# Altium schematic sheet ELOAD.SchDoc: =DocumentName
size 420 x 297 mm; CompanyName: "AS Manufacturing" LLC; Organization: "AS Manufacturing" LLC; Address1: 5 Sklyarenka St.; Address2: Kyiv 04073; Address3: Ukraine; Address4: https://ajax.systems/en/; DocumentNumber: 1; SheetNumber: 1; SheetTotal: 7; Template_version: 1.0.1
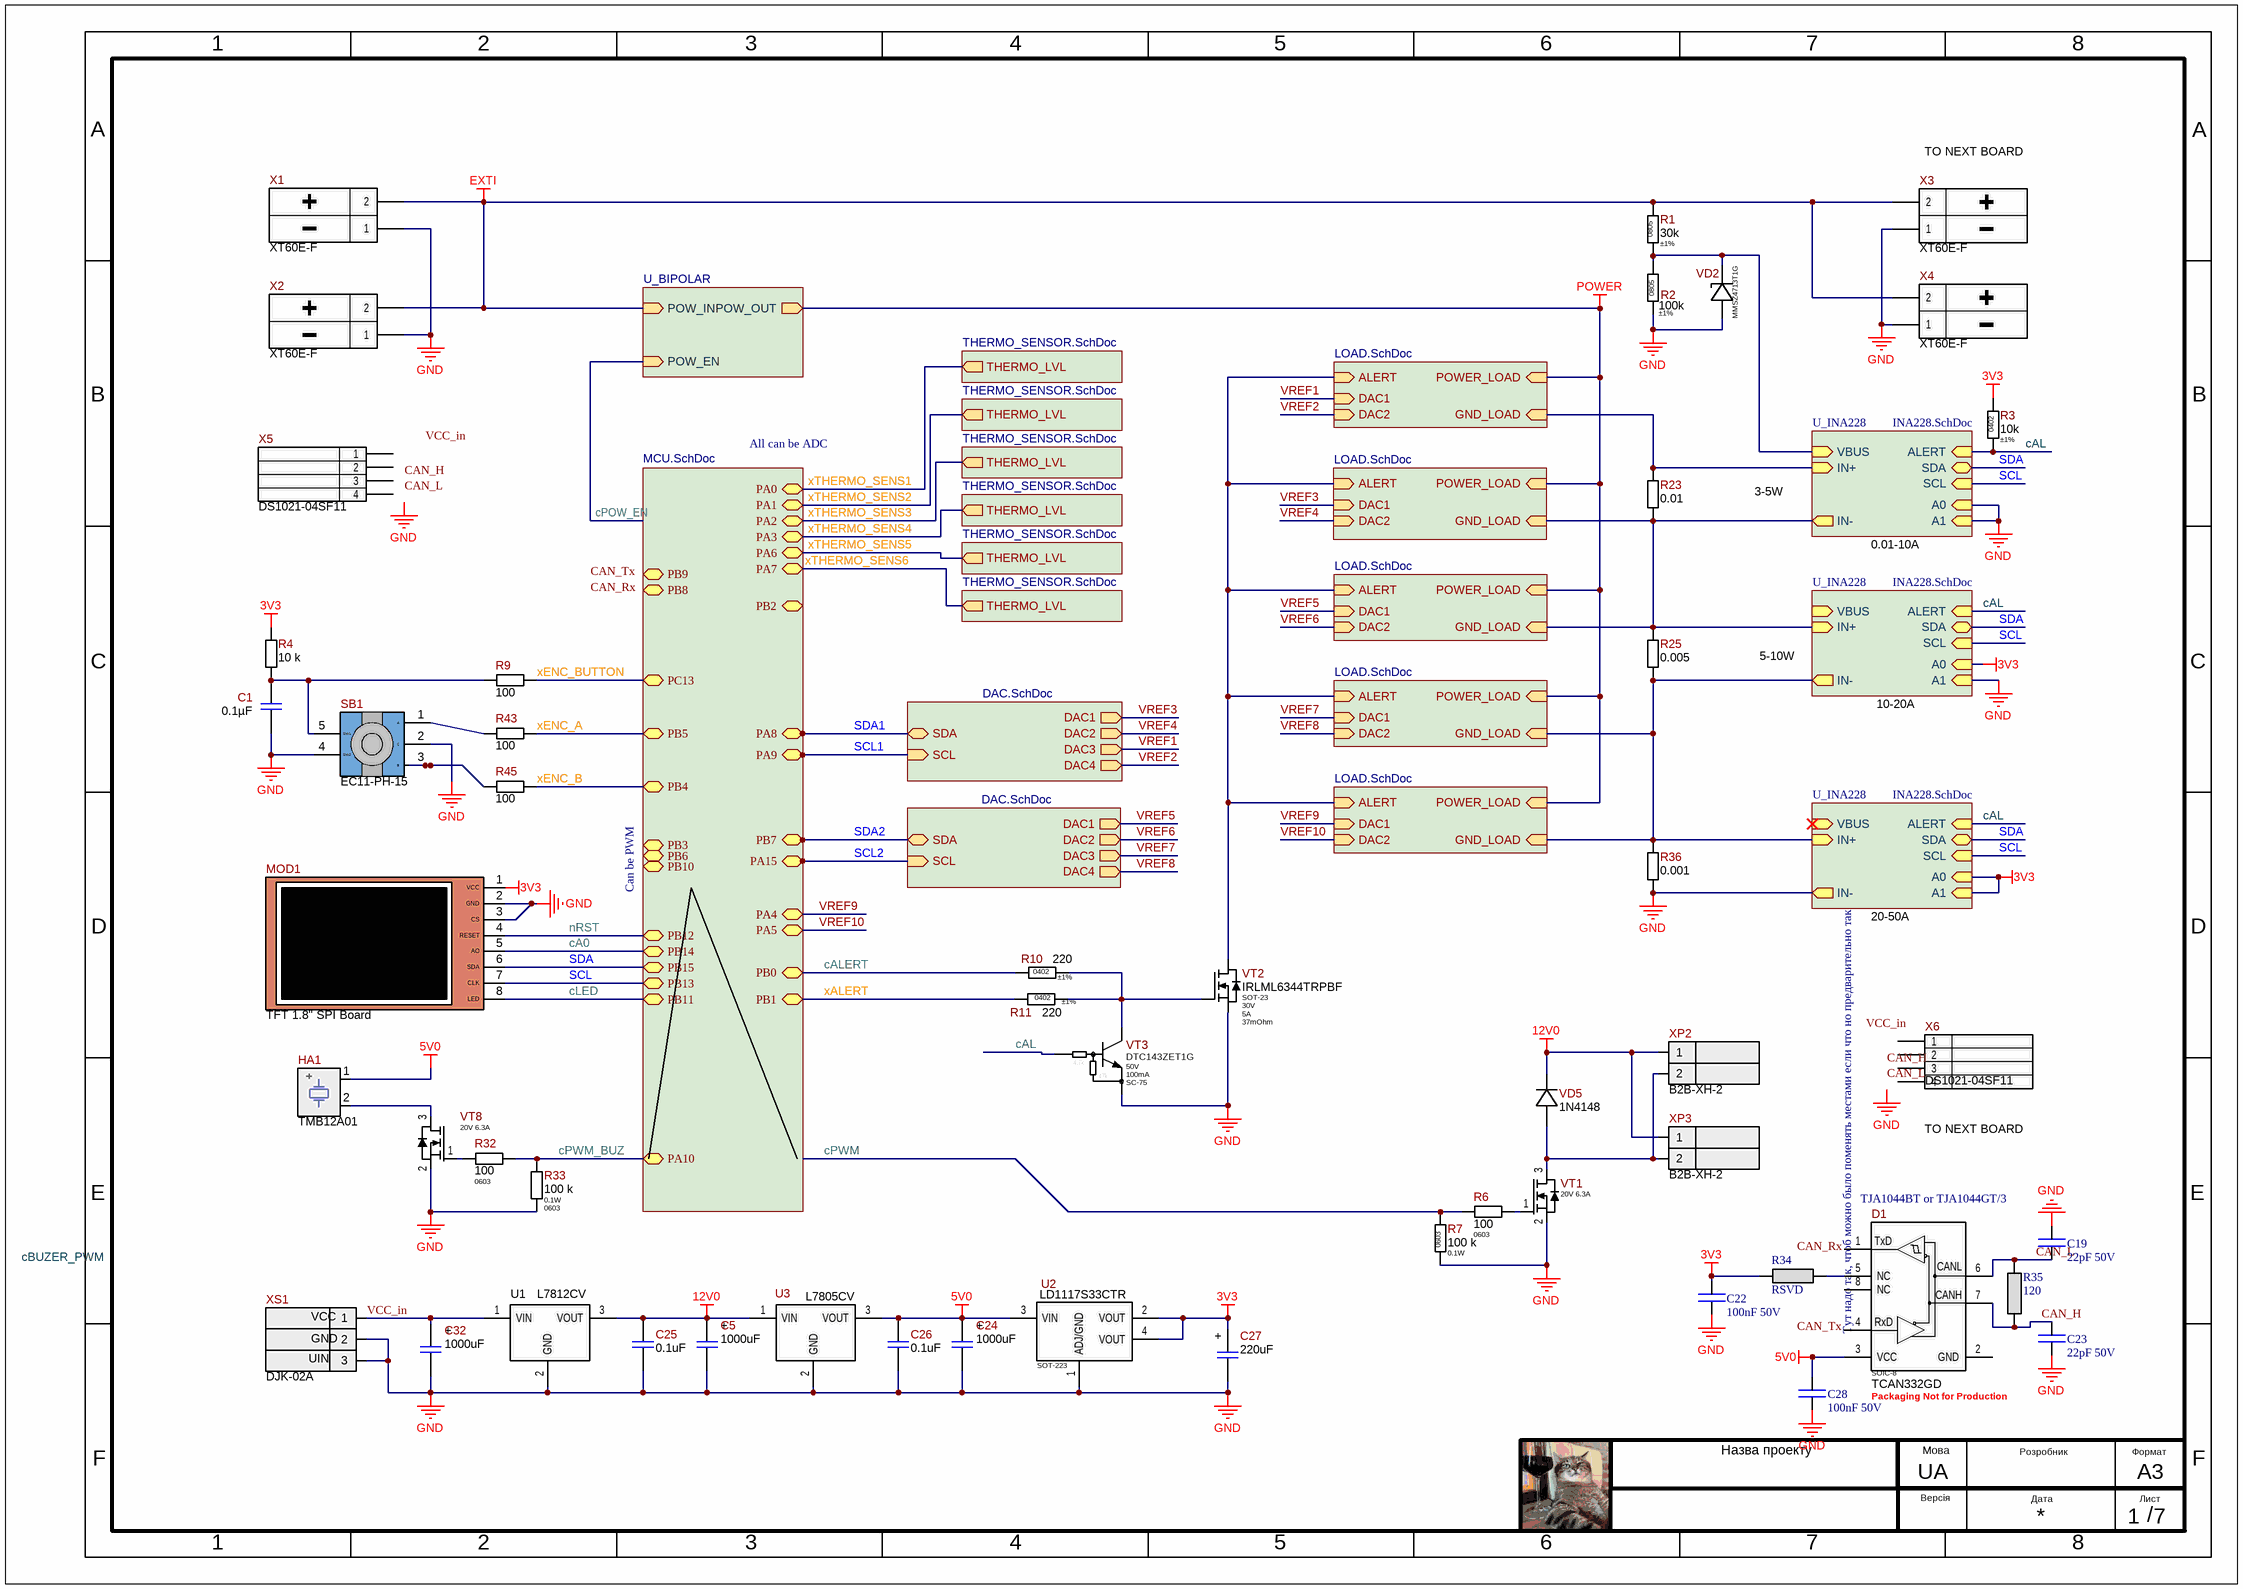
[diagram p0: ELOAD.SchDoc]

## Parts
C1  0.1µF  [C0603(1608)]
C5  1000uF  [CAP 10x16]
C19  22pF 50V  [0805CAP]
C22  100nF 50V  [0805CAP]
C23  22pF 50V  [0805CAP]
C24  1000uF  [CAP 10x16]
C25  0.1uF  [C0603(1608)]
C26  0.1uF  [C0603(1608)]
C27  220uF  [CASE_D(7343)]
C28  100nF 50V  [0805CAP]
C32  1000uF  [CAP 10x16]
D1  Package: SOIC-8  Lifecycle: Packaging Not for Production  [SOIC-8_W3.9MM]  (hidden comment: TCAN332GD)
HA1  TMB12A01  [KPX-1205A]
MOD1  TFT 1.8" SPI Board  [1.8_TFT_BOARD]
R1  Tolerance: ±1%  Package: 0805  [R_ANY_CHIP_0805_MED]  (hidden comment: 30k)
R2  Tolerance: ±1%  Package: 0805  [R_ANY_CHIP_0805_MED]  (hidden comment: 100k)
R3  Tolerance: ±1%  Package: 0402  [R_ANY_CHIP_0402_MED]  (hidden comment: 10k)
R4  10 k  [R0603]
R6  100  Package/Case: 0603  [R0603]
R7  100 k  Power Rating: 0.1W  Package/Case: 0603  [R0603]
R9  100  [R0603]
R10  Tolerance: ±1%  Package: 0402  [R_ANY_CHIP_0402_MED]  (hidden comment: 220)
R11  Tolerance: ±1%  Package: 0402  [R_ANY_CHIP_0402_MED]  (hidden comment: 220)
R23  0.01  [SHUNT10]
R25  0.005  [SHUNT10]
R32  100  Package/Case: 0603  [R0603]
R33  100 k  Power Rating: 0.1W  Package/Case: 0603  [R0603]
R34  RSVD  [RES0402]
R35  120  [Res0805]
R36  0.001  [SHUNT10]
R43  100  [R0603]
R45  100  [R0603]
SB1  EC11-PH-15  [EC11-PH-15]
U1  L7812CV  [TO220-AB-H]
U2  Package: SOT-223  Part Number: LD1117S33CTR  [SOT223]  (hidden comment: LD1117STR)
U3  L7805CV  [DPAK]
VD2  MMSZ4713T1G  [SOD-123_MED]
VD5  1N4148  [D0805]
VT1  Power Rating: 20V 6.3A  [SOT-23]  (hidden comment: IRLML6244)
VT2  Part Number: IRLML6344TRPBF  Package: SOT-23  Vds: 30V  Id: 5A  Rds: 37mOhm  [SOT-23_MED]  (hidden comment: IRLML6344)
VT3  Vce: 50V  Ic: 100mA  Package: SC-75  [SOT-416]  (hidden comment: DTC143ZET1G)
VT8  Power Rating: 20V 6.3A  [SOT-23]  (hidden comment: IRLML6244)
X1  XT60E-F  [XT60E-F]
X2  XT60E-F  [XT60E-F]
X3  XT60E-F  [XT60E-F]
X4  XT60E-F  [XT60E-F]
X5  Part Number: DS1021-04SF11  [DS1021-04S]  (hidden comment: PLS-4 (Part of PLS-40))
X6  Part Number: DS1021-04SF11  [DS1021-04S]  (hidden comment: PLS-4 (Part of PLS-40))
XP2  B2B-XH-2  [B2B-XH-2]
XP3  B2B-XH-2  [B2B-XH-2]
XS1  DJK-02A  [DC-140-003]

## Sub-sheets
LOAD = LOAD.SchDoc: DAC1 (in), ALERT (in), POWER_LOAD (in), DAC2 (in), GND_LOAD (in)
LOAD = LOAD.SchDoc: DAC1 (in), ALERT (in), POWER_LOAD (in), DAC2 (in), GND_LOAD (in)
LOAD = LOAD.SchDoc: DAC1 (in), ALERT (in), POWER_LOAD (in), DAC2 (in), GND_LOAD (in)
LOAD = LOAD.SchDoc: DAC1 (in), ALERT (in), POWER_LOAD (in), DAC2 (in), GND_LOAD (in)
LOAD = LOAD.SchDoc: DAC1 (in), ALERT (in), POWER_LOAD (in), DAC2 (in), GND_LOAD (in)
THERMO_SENSOR = THERMO_SENSOR.SchDoc: THERMO_LVL (out)
THERMO_SENSOR = THERMO_SENSOR.SchDoc: THERMO_LVL (out)
THERMO_SENSOR = THERMO_SENSOR.SchDoc: THERMO_LVL (out)
THERMO_SENSOR = THERMO_SENSOR.SchDoc: THERMO_LVL (out)
THERMO_SENSOR = THERMO_SENSOR.SchDoc: THERMO_LVL (out)
THERMO_SENSOR = THERMO_SENSOR.SchDoc: THERMO_LVL (out)
U_BIPOLAR = INKEY.SchDoc: POW_EN (in), POW_IN (in), POW_OUT (out)
U_DAC = DAC.SchDoc: SCL (in), SDA (bidir), DAC1 (out), DAC2 (out), DAC3 (out), DAC4 (out)
U_DAC = DAC.SchDoc: SCL (in), SDA (bidir), DAC1 (out), DAC2 (out), DAC3 (out), DAC4 (out)
U_INA228 = INA228.SchDoc: IN+ (in), IN- (out), A0 (in), ALERT (in), VBUS (in), A1 (in), SCL (in), SDA (bidir)
U_INA228 = INA228.SchDoc: IN+ (in), IN- (out), A0 (in), ALERT (in), VBUS (in), A1 (in), SCL (in), SDA (bidir)
U_INA228 = INA228.SchDoc: IN+ (in), IN- (out), A0 (in), ALERT (in), VBUS (in), A1 (in), SCL (in), SDA (bidir)
U_MTB.ESP32-S3 = MCU.SchDoc: PA0 (bidir), PA1 (bidir), PA2 (bidir), PA3 (bidir), PA4 (bidir), PA5 (bidir), PA6 (bidir), PA7 (bidir), PA8 (bidir), PA9 (bidir), PA10 (bidir), PA15 (bidir), PB0 (bidir), PB1 (bidir), PB2 (bidir), PB3 (bidir), PB4 (bidir), PB5 (bidir), PB6 (bidir), PB7 (bidir), PB8 (bidir), PB9 (bidir), PB10 (bidir), PB11 (bidir), PB12 (bidir), PB13 (bidir), PB14 (bidir), PB15 (bidir), PC13 (bidir)

## Nets
3V3: C22.2 C27.1 MOD1.1(VCC) R3.1 R4.2 R34.1 U2.2(VOUT) U2.4(VOUT) ; sheet U_INA228/A0, sheet U_INA228/A0, sheet U_INA228/A1
5V0: C24.1 C26.1 C28.2 D1.3(VCC) HA1.1(Vcc) U2.3(VIN) U3.3(VOUT)
12V0: C5.1 C25.1 U1.3(VOUT) U3.1(VIN) VD5.1(K) XP2.1 XP3.1
EXTI: R1.1 X1.2 X2.2 X3.2 X4.2 ; sheet U_BIPOLAR/POW_IN
GND: C1.2 C5.2 C19.2 C22.1 C23.1 C24.2 C25.2 C26.2 C27.2 C28.1 C32.2 MOD1.2(GND) MOD1.3(CS) R2.2 R7.1 R33.1 R36.1 SB1.2(C) SB1.4(SW2) U1.2(GND) U2.1(ADJ/GND) U3.2(GND) VD2.AN VT1.2(S) VT2.2(S) VT3.2(E) VT8.2(S) X1.1 X2.1 X3.1 X4.1 XS1.2 XS1.3 ; sheet U_INA228/A0, sheet U_INA228/A1, sheet U_INA228/A1, sheet U_INA228/IN-
POWER: sheet U_BIPOLAR/POW_OUT, sheet LOAD/POWER_LOAD, sheet LOAD/POWER_LOAD, sheet LOAD/POWER_LOAD, sheet LOAD/POWER_LOAD, sheet LOAD/POWER_LOAD
cA0: MOD1.5(AO) ; sheet U_MTB.ESP32-S3/PB14
cAL: R3.2 VT3.1(B) ; sheet U_INA228/ALERT, sheet U_INA228/ALERT, sheet U_INA228/ALERT
cALERT: R10.1 ; sheet U_MTB.ESP32-S3/PB0
CAN_H: C23.2 D1.7(CANH) R35.1
CAN_L: C19.1 D1.6(CANL) R35.2
cLED: MOD1.8(LED) ; sheet U_MTB.ESP32-S3/PB11
cPOW_EN: sheet U_BIPOLAR/POW_EN
cPWM: R6.1 R7.2
cPWM_BUZ: R32.1 R33.2 ; sheet U_MTB.ESP32-S3/PA10
nRST: MOD1.4(RESET) ; sheet U_MTB.ESP32-S3/PB12
SCL: MOD1.7(CLK) ; sheet U_MTB.ESP32-S3/PB13, sheet U_INA228/SCL, sheet U_INA228/SCL, sheet U_INA228/SCL
SCL1: sheet U_MTB.ESP32-S3/PA9, sheet U_DAC/SCL
SCL2: sheet U_MTB.ESP32-S3/PA15, sheet U_DAC/SCL
SDA: MOD1.6(SDA) ; sheet U_MTB.ESP32-S3/PB15, sheet U_INA228/SDA, sheet U_INA228/SDA, sheet U_INA228/SDA
SDA1: sheet U_MTB.ESP32-S3/PA8, sheet U_DAC/SDA
SDA2: sheet U_MTB.ESP32-S3/PB7, sheet U_DAC/SDA
VCC_in: C32.1 U1.1(VIN) XS1.1
VREF1: sheet U_DAC/DAC3, sheet LOAD/DAC1
VREF2: sheet U_DAC/DAC4, sheet LOAD/DAC2
VREF3: sheet U_DAC/DAC1, sheet LOAD/DAC1
VREF4: sheet U_DAC/DAC2, sheet LOAD/DAC2
VREF5: sheet U_DAC/DAC1, sheet LOAD/DAC1
VREF6: sheet U_DAC/DAC2, sheet LOAD/DAC2
VREF7: sheet U_DAC/DAC3, sheet LOAD/DAC1
VREF8: sheet U_DAC/DAC4, sheet LOAD/DAC2
VREF9: sheet U_MTB.ESP32-S3/PA4, sheet LOAD/DAC1
VREF10: sheet U_MTB.ESP32-S3/PA5, sheet LOAD/DAC2
xALERT: R11.1 ; sheet U_MTB.ESP32-S3/PB1
xENC_A: R43.2 ; sheet U_MTB.ESP32-S3/PB5
xENC_B: R45.2 ; sheet U_MTB.ESP32-S3/PB4
xENC_BUTTON: R9.2 ; sheet U_MTB.ESP32-S3/PC13
xTHERMO_SENS1: sheet THERMO_SENSOR/THERMO_LVL, sheet U_MTB.ESP32-S3/PA0
xTHERMO_SENS2: sheet U_MTB.ESP32-S3/PA1, sheet THERMO_SENSOR/THERMO_LVL
xTHERMO_SENS3: sheet U_MTB.ESP32-S3/PA2, sheet THERMO_SENSOR/THERMO_LVL
xTHERMO_SENS4: sheet U_MTB.ESP32-S3/PA3, sheet THERMO_SENSOR/THERMO_LVL
xTHERMO_SENS5: sheet U_MTB.ESP32-S3/PA6, sheet THERMO_SENSOR/THERMO_LVL
xTHERMO_SENS6: sheet U_MTB.ESP32-S3/PA7, sheet THERMO_SENSOR/THERMO_LVL
NetC1_1: C1.1 R4.1 R9.1 SB1.5(SW1)
NetD1_5: D1.5(NC) R34.2
NetHA1_2: HA1.2(GND) VT8.3(D)
NetR1_2: R1.2 R2.1 VD2.CA ; sheet U_INA228/VBUS
NetR6_2: R6.2 VT1.1(G)
NetR10_2: R10.2 R11.2 VT2.1(G) VT3.3(C)
NetR23_1: R23.1 R25.2 ; sheet U_INA228/IN-, sheet U_INA228/IN+, sheet LOAD/GND_LOAD, sheet LOAD/GND_LOAD
NetR23_2: R23.2 ; sheet U_INA228/IN+, sheet LOAD/GND_LOAD
NetR25_1: R25.1 R36.2 ; sheet U_INA228/IN-, sheet U_INA228/IN+, sheet LOAD/GND_LOAD, sheet LOAD/GND_LOAD
NetR32_2: R32.2 VT8.1(G)
NetR43_1: R43.1 SB1.1(A)
NetR45_1: R45.1 SB1.3(B)
NetVD5_2: VD5.2(A) VT1.3(D) XP2.2 XP3.2
NetVT2_3: VT2.3(D) ; sheet LOAD/ALERT, sheet LOAD/ALERT, sheet LOAD/ALERT, sheet LOAD/ALERT, sheet LOAD/ALERT

Not connected (* = marked no-connect by the designer): D1 1(TxD) 2(GND) 4(RxD) 8(NC); X5 1 2 3 4; X6 1 2 3 4

## Notes on the sheet
- (near X3) TO NEXT BOARD
- All can be ADC
- 3-5W
- 0.01-10A
- 5-10W
- 10-20A
- Can be PWM
- 20-50A
- (near X6) TO NEXT BOARD
- TJA1044BT or TJA1044GT/3
- Тут надо так, чтоб можно было поменять местами если что но предварительно так
- Labels drawn without touching a wire or pin: CAN_H, CAN_L, CAN_Rx, CAN_Tx, cBUZER_PWM, GND, VCC_in
- 1
- 2
- 3
- 4
- 5
- 6
- 7
- 8
- A
- B
- C
- D
- E
- F
- Назва проекту
- Мова
- UA
- Розробник
- Формат
- A3
- Версія
- Дата
- Лист
- /
- (in symbol 220uF  10V CASE-D) +
- (in symbol 1000uF  16V 10x16(EHR)) +
- (in symbol DJK-02A) VCC; GND; UIN
- (in symbol DTC143ZET1G) 4.7k; 47k

## Library data of the parts
C1 = 0.1µF  50V C0603: CAP CER 0.1UF 50V X7R 0603; Manufacturer: Samsung Electro-Mechanics; Manufacturer P/N: CL10B104KB8WPNC; Name Component: Capacitor Ceramic; Tolerance: ±10%; Operation Temperature: -55°C ~ 125°C; Notes: 06035C104K4T4A, 06035C104K4T2A; Library Path 1: Capacitors.SchLib; Part Number: 0.1µF  50V C0603; Value: 0.1µF; Temperature Coefficient: X7R; Power (V/A): 50V; Package/Case: C0603; Supplier 1: Digi-key; Supplier Part Number 1: 1276-6854-2-ND; ComponentLink1Description: Datasheet; ComponentLink1URL: https://www.samsungsem.com/resources/file/global/support/product_catalog/MLCC.pdf
C5 C24 C32 = 1000uF  16V 10x16(EHR): 1000uF 20% 16V EHR 10x16mm; Manufacturer: Hitano; Manufacturer P/N: EHR102M16BA; Name Component: Electrolytic capacitor; Operation Temperature: −40°C to +105°C; Library Path 1: Capacitors.SchLib; Part Number: 1000uF  16V 10x16(EHR); Value: 1000uF; Tolerance: ±20%; Power (V/A): 16V; Package/Case: 10x16(EHR); Supplier 1: RCS; ComponentLink1Description: Datasheet; ComponentLink1URL: https://www.rcscomponents.kiev.ua/datasheets/EHR_081225.pdf
C19 C22 C23 C28 = CAP0805: 0805 CAP 100nF 50V
C25 C26 = 0.1uF  50V C0603: CAP CER 0.1UF 50V X7R 0603; Manufacturer: Samsung Electro-Mechanics; Manufacturer P/N: CL10B104KB8WPNC; Name Component: Capacitor Ceramic; Tolerance: ±10%; Operation Temperature: -55°C ~ 125°C; Library Path 1: Capacitors.SchLib; Notes: 06035C104K4T4A, 06035C104K4T2A; Part Number: 0.1uF  50V C0603; Value: 0.1uF; Temperature Coefficient: X7R; Power (V/A): 50V; Package/Case: C0603; Supplier Part Number 1: 1276-6854-2-ND; ComponentLink1Description: Datasheet; Supplier 1: Digi-key; ComponentLink1URL: https://www.samsungsem.com/resources/file/global/support/product_catalog/MLCC.pdf
C27 = 220uF  10V CASE-D: CAP TANT 220UF 20% 10V 2917; Manufacturer: KEMET; Manufacturer P/N: T491D227M010AT; Name Component: CapacitorTantalum; Operation Temperature: -55°C ~ 125°C; Library Path 1: Capacitors.SchLib; Part Number: 220uF  10V CASE-D; Value: 220uF; Tolerance: ±20%; Temperature Coefficient: -; Power (V/A): 10V; Package/Case: CASE-D; Supplier 1: Digi-key; Supplier Part Number 1: 399-9744-2-ND; ComponentLink1Description: Datasheet; ComponentLink1URL: https://content.kemet.com/datasheets/KEM_T2005_T491.pdf
D1 = TCAN332GD: 3.3V Half Duplex CAN Transceivers with CAN FD, 5 Mbps, SOIC-8; Manufacturer: Texas Instruments; Ajax_1C_PN: NONE; Ajax_1С_Status: RND Only; Component Status: Released; Standard Lead Time: 56 Weeks; Part Number: TCAN332GD; Part Type: Transceivers / CAN; Component Type: SMD; Temperature Range: -40°C ~ 125°C; ComponentLink1URL: https://www.ti.com/lit/ds/symlink/tcan334g.pdf; Supplier 1: Mouser; Supplier Part Number 1: 595-TCAN332GD; Replacement: NONE; Price: NONE; ComponentLink1Description: Datasheet
HA1 = TMB12A01: AUDIO MAGNETIC 1.2-2.5 V; Name Component: Buzzer; Operation Temperature: -20 °C to +70 °C; Power (V/A): 1,2...2,5 V; Library Path 1: Others.SchLib; ComponentDescription: Buzzer  TMB12A01  (12x9.5); Part Number: TMB12A01; Value: TMB12A01; Supplier 1: Kosmodrom; Supplier Part Number 1: TMB12A01; ComponentLink1Description: Datasheet; ComponentLink1URL: http://www.kosmodrom.com.ua/el.php?name=TMB12A01; AbridgedComponentDescription: TMB12A01; Package/Case: 12x9.5
MOD1 = TFT 1.8" SPI Board: Display Board TFT 1.8" SPI Driver ST7735S with SD; Operation Temperature: -40°C ~ 85°C; Power (V/A): 3.3 V; Library Path 1: Module.SchLib; Part Number: TFT 1.8" SPI Board; Name Component: Display; Value: TFT 1.8" SPI Board; Package/Case: 56x35mm; ComponentLink1Description: Datasheet
R1 = RC0805FR-0730KL: 30 kOhms ±1%, 1/8W 0805 Thick Film Resistor; Manufacturer: Yageo; Ajax_1C_ID: 9642; Ajax_1C_PN: 30k 1% 0805 Resistors SMD RoHS; Ajax_1С_Status: Mass Production; Power Rating: 0.125W; Voltage: 150V; Component Status: Released; Temperature Stability: ±100ppm/°C; Replacement: NONE; GUID_1C: 71e2aa09-07e0-11e7-82d0-d8cb8a9acc66; Value: 30k; Part Number: RC0805FR-0730KL; Component Type: SMD; Part Type: Thick Film; Temperature Range: -55°C ~ 155°C; ComponentLink1URL: https://eu.mouser.com/datasheet/2/447/PYu_RC_Group_51_RoHS_L_10-1664068.pdf; Supplier 1: Digi-Key; Supplier Part Number 1: 311-30.0KCRTR-ND; Price: 0.0014; ComponentLink1Description: Datasheet
R2 = RC0805FR-07100KL: 100 kOhms ±1%, 1/8W 0805 Thick Film Resistor; Manufacturer: Yageo; Ajax_1C_ID: 7487; Ajax_1C_PN: 100k 1% 0805 Resistors SMD RoHS; Ajax_1С_Status: Mass Production; Power Rating: 0.125W; Voltage: 150V; Component Status: Released; Temperature Stability: ±100ppm/°C; Replacement: NONE; GUID_1C: 0fb4516d-b2dc-11e5-8119-d8cb8a9acc66; Value: 100k; Part Number: RC0805FR-07100KL; Component Type: SMD; Part Type: Thick Film; Temperature Range: -55°C ~ 155°C; ComponentLink1URL: https://eu.mouser.com/datasheet/2/447/PYu_RC_Group_51_RoHS_L_10-1664068.pdf; Supplier 1: Digi-Key; Supplier Part Number 1: 311-100KCRTR-ND; Price: 0.0014; ComponentLink1Description: Datasheet
R3 R10 R11 = RC0402FR-07220RL: 220 Ohms ±1% 1/16W 0402 Thick Film Resistor; Manufacturer: Yageo; Ajax_1C_ID: 6466; Ajax_1C_PN: 220R 1% 0402 Resistors SMD RoHS; Power Rating: 0.062W; Voltage: 50V; Temperature Stability: ±100ppm/°C; Replacement: NONE; Ajax_1С_Status: Mass Production; Component Status: Released; GUID_1C: c8eea36b-fd66-11e4-ad28-a45d36c4a9e5; Part Number: RC0402FR-07220RL; Component Type: SMD; Temperature Range: -55°C ~ 155°C; ComponentLink1URL: https://eu.mouser.com/datasheet/2/447/PYu_RC_Group_51_RoHS_L_10-1664068.pdf; ComponentLink1Description: Datasheet; Part Type: Thick Film; Price: 0.00065
  R3: Value: 10k
  R10 R11: Value: 220
R4 = 10 k  R0603: RES SMD 10 k OHM  ±1% 1/10W 0603; Power Rating: 0.1W; Name Component: Resistror; Operation Temperature: -55℃ to 155℃; Temperature Coefficient: ±100 ppm/°C; Library Path 1: Resistor.SchLib; Value: 10 k; Part Number: 10 k  R0603
R6 R32 = 100  R0603: RES SMD 100 OHM  ±1% 1/10W 0603; Power Rating: 0.1W; Name Component: Resistror; Operation Temperature: -55℃ to 155℃; Temperature Coefficient: ±100 ppm/°C; Library Path 1: Resistor.SchLib; Part Number: 100  R0603; Value: 100; Tolerance: ±1%
R7 R33 = 100 k  R0603: RES SMD 100 k OHM  ±1% 1/10W 0603; Name Component: Resistror; Operation Temperature: -55℃ to 155℃; Temperature Coefficient: ±100 ppm/°C; Library Path 1: Resistor.SchLib; Part Number: 100 k  R0603; Value: 100 k; Tolerance: ±1%
R9 R43 R45 = 100  R0603: RES SMD 100 OHM  ±1% 1/10W 0603; Name Component: Resistror; Operation Temperature: -55℃ to 155℃; Temperature Coefficient: ±100 ppm/°C; Library Path 1: Resistor.SchLib; Part Number: 100  R0603; Value: 100; Tolerance: ±1%
R23 R25 R36 = 0.001  Resistor: SHUNT; Name Component: Resistror; Tolerance: ±5%; Operation Temperature: -55℃ to 155℃; Temperature Coefficient: ±200 ppm/°C; Library Path 1: Resistor.SchLib; Part Number: 0.001  Resistor
  R23: Value: 0.01
  R25: Value: 0.005
  R36: Value: 0.001
R34 = RES0402: 0402 RES 10k
R35 = RES0805: 0805 RES 120
SB1 = EC11-PH-15: Alps Alpine; Manufacturer P/N: EC11E15244B2; Operation Temperature: -20°C ~ 70°C; Power (V/A): 5V 10mA; Library Path 1: Switches.SchLib; Part Number: EC11-PH-15; Name Component: Encoder; Value: EC11-PH-15; Supplier 1: Digi-key; ComponentLink1Description: Datasheet; ComponentLink1URL: https://tech.alpsalpine.com/e/products/detail/EC11E15244B2/; AbridgedComponentDescription: EC11-PH-15
U1 = L7812CV: IC REG LINEAR 12V 500MA DPAK; Manufacturer: STMicroelectronics; Name Component: Linear Voltage Regulator; Operation Temperature: 0°C ~ 150°C; Power (V/A): 14 ... 35V; Library Path 1: Power converters.SchLib; ComponentDescription: Linear Voltage Regulator L7812CV   (D-PAK); Part Number: L7812CV; Value: L7812CV; Package/Case: D-PAK; Supplier 1: Digi-key; ComponentLink1Description: Datasheet; ComponentLink1URL: https://mm.digikey.com/Volume0/opasdata/d220001/medias/docus/2578/L78MxxAB%2CAC%20.pdf
U2 = LD1117S33CTR: IC REG LINEAR 3.3V 800MA SOT223; Manufacturer: STMicroelectronics; Name Component: Linear Regulators; Operation Temperature: -40°C ~ 125°C; Power (V/A): 0.8 A 3.3 В; Library Path 1: Power converters.SchLib; ComponentDescription: Linear Regulators  LD1117S33CTR  (SOT-223); Part Type: Power / Linear Regulator; Component Type: SMD; Temperature Range: 0°C ~ 125°C; ComponentLink1URL: https://www.st.com/content/ccc/resource/technical/document/datasheet/99/3b/7d/91/91/51/4b/be/CD00000544.pdf/files/CD00000544.pdf/jcr:content/translations/en.CD00000544.pdf; Supplier 1: Digi-key; Supplier Part Number 1: 497-1241-2-ND; Price: 0,11994941; ComponentLink1Description: Datasheet; Value: LD1117S33CTR; Package/Case: SOT-223; Manufacturer P/N: LD1117S33CTR
U3 = L7805CV: IC REG LINEAR 5V 1.5A DPAK; Manufacturer: STMicroelectronics; Manufacturer P/N: L7805CDT-TR; Name Component: Linear Voltage Regulator; Operation Temperature: 0°C ~ 150°C; Power (V/A): 5V 1.5A; Library Path 1: Power converters.SchLib; ComponentDescription: Linear Voltage Regulator L7805CV   (TO-220); Part Number: L7805CV; Value: L7805CV; Package/Case: TO-220; Supplier 1: Digi-key; Supplier Part Number 1: 497-7255-2-ND; ComponentLink1Description: Datasheet
VD2 = MMSZ4713T1G: Zener Diode 30V, 500mW, ±5%, SOD-123; Manufacturer: Onsemi; Ajax_1C_ID: 49763; Ajax_1C_PN: MMSZ4713T1G SOD123 30V Zener Diode OnSemi; Ajax_1С_Status: RND Only; Component Status: Released; Marking: ED; Standard Lead Time: 52 Weeks; Replacement: NONE; GUID_1C: 9c895df6-3100-11ed-a363-005056994834; Part Number: MMSZ4713T1G; Package: SOD-123; Voltage: 30V; Part Type: Zener; Component Type: SMD; Temperature Range: -55°C ~ 150°C; ComponentLink1URL: https://eu.mouser.com/datasheet/2/308/MMSZ4678T1_D-1389385.pdf; Supplier 1: Mouser; Supplier Part Number 1: 863-MMSZ4713T1G; Price: 0.031; ComponentLink1Description: Datasheet
VD5 = 1N4148: DIODE GEN PURP 75V 250MA SOD323; Manufacturer: Diodes Incorporated; Operation Temperature: -55°C ~ 150°C; Library Path 1: Diodes.SchLib; Power Rating: 75V 250mA; Part Number: 1N4148; Name Component: Diode; Value: 1N4148; Package/Case: SOD-80; Manufacturer P/N: 1N4148; Supplier 1: Digi-key; Supplier Part Number 1: 1N4148; ComponentLink1Description: Datasheet
VT1 VT8 = IRLML6244: MOSFET N-CH 20V 6.3A SOT-23; Manufacturer: InfineonTechnologies; Manufacturer P/N: IRLML6244TRPBF; Name Component: Transistor; Operation Temperature: -55°C ~ 150°C (TJ); Library Path 1: Transistors.SchLib; ComponentLink1URL: https://www.infineon.com/dgdl/irlml6244pbf.pdf?fileId=5546d462533600a4015356686fed261f; ComponentLink1Description: Datasheet; Part Number: IRLML6244; Value: IRLML6244; Package/Case: SOT-23; Supplier 1: Digi-key; Supplier Part Number 1: IRLML6244TRPBFTR-ND
VT2 = IRLML6344TRPBF: 30V, 5A max N-Channel HEXFET MOSFET, 29mOhm @ Vgs = 4.5V; Manufacturer: Infineon Technologies; Ajax_1C_ID: 9416; Ajax_1C_PN: IRLML6344TRPBF  SOT23. полевой транзистор; Ajax_1С_Status: Mass Production; Component Status: Released; Standard Lead Time: 16 Weeks; Replacement: NONE; GUID_1C: 8299d48f-df0c-11e6-829c-d8cb8a9acc66; Part Type: N-Channel; Component Type: SMD; Temperature Range: -55°C ~ 150°C; ComponentLink1URL: https://www.infineon.com/dgdl/irlml6344pbf.pdf?fileId=5546d462533600a4015356689c44262c; Supplier 1: Digi-Key; Supplier Part Number 1: IRLML6344TRPBFTR-ND; Price: 0.175; ComponentLink1Description: Datasheet
VT3 = DTC143ZET1G: 50V, 100mA Low Vce(sat) NPN Digital Transistor, Pre-Biased 4.7k/47k (with built-in resistors); Manufacturer: Onsemi; Ajax_1C_ID: 9410; Ajax_1C_PN: DTC143ZET1G SC-75-3  биполярный NPN транзистор; Ajax_1С_Status: Mass Production; Component Status: Released; Standard Lead Time: 8 Weeks; Replacement: NONE; GUID_1C: d76ac5d5-de69-11e6-829b-d8cb8a9acc66; Part Number: DTC143ZET1G; Part Type: NPN; Component Type: SMD; Temperature Range: -55°C ~ 150 °C; ComponentLink1URL: http://www.onsemi.com/pub/Collateral/DTC143Z-D.PDF; Supplier 1: Digi-Key; Supplier Part Number 1: DTC143ZET1GOSTR-ND; Price: 0,0125; ComponentLink1Description: Datasheet
X1-X4 = XT60E-F: 2 Pin DC Power Socket, XT60, Female, Straight, Yellow, 30A, 500V, Gold Flash; Manufacturer: Amass; Ajax_1C_PN: NONE; Ajax_1С_Status: RND Only; Component Status: Review_1; Part Number: XT60E-F; Part Type: Power Socket; Component Type: PTH; Temperature Range: -20°C ~ 120°C; ComponentLink1URL: https://www.tme.eu/Document/172e3180ebad396a946f7e08df14c4b2/XT60E-F.pdf; Supplier 1: TME; Supplier Part Number 1: XT60E-F; Replacement: NONE; Price: NONE; ComponentLink1Description: Datasheet
X5 X6 = DS1021-04SF11: 4 Pin 2.54mm Male Header, Vertical, 3mm and 6.1mm, PLS-4; Manufacturer: Connfly; Ajax_1C_ID: 1215; Ajax_1C_PN: PLS40, планки зі штирьками; Ajax_1С_Status: Mass Production; Component Status: Released; Replacement: NONE; GUID_1C: 10be163c-dd40-11e0-af93-6c626deda1bb; Part Type: Header / Male Pin / Single Row; Component Type: PTH; Temperature Range: -40°C ~ 105°C; ComponentLink1URL: \\altiumdb.ajax.local\files\Datasheet\Connectors\DS1021.pdf; Price: 0.00351512; ComponentLink1Description: Datasheet
XP2 XP3 = B2B-XH-2: CONN HEADER VERT 2POS 2.5MM; Manufacturer: JSTSalesAmericaInc.; Manufacturer P/N: B2B-XH-2(LF)(SN); Name Component: PCB Connector; Operation Temperature: -25°C ~ 85°C; Power (V/A): 3A/250V; Library Path 1: Connectors.SchLib; Part Number: B2B-XH-2; Value: B2B-XH-2; Package/Case: 2.5mm; Supplier 1: Digi-key; ComponentLink1Description: Datasheet; ComponentLink1URL: http://www.jst-belgium.be/downloads/series/TSSC018.00(XH).pdf
XS1 = DJK-02A: DC POWER JACK CONNECTOR 6.3MM; Manufacturer: KLS; Name Component: Power socket; Operation Temperature: -25°C ~ 85°C; Power (V/A): 2A/250V; Library Path 1: Connectors.SchLib; Part Number: DJK-02A; Value: DJK-02A; Package/Case: DJK-02A; Manufacturer P/N: DJK-02A; Supplier 1: -; ComponentLink1Description: Datasheet; ComponentLink1URL: https://static.chipdip.ru/lib/078/DOC001078433.pdf; System: Connector